# EAGLE design untitled (EAGLE 6.4)
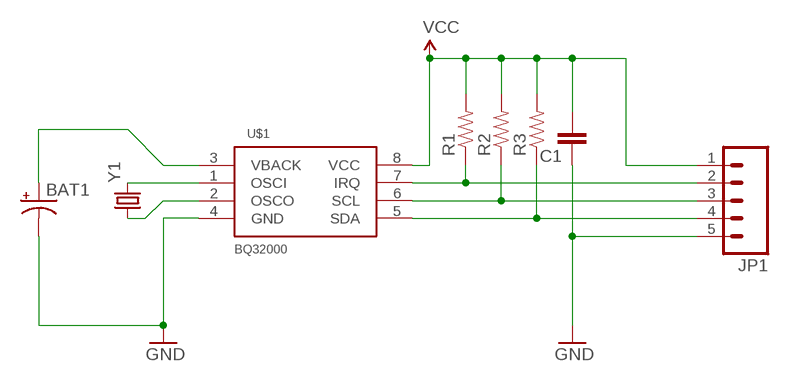
[diagram p0: schematic, sheet 1]

## Parts
BAT1  CAP_POLPTH3  [CPOL-RADIAL-1000UF-63V]
C1  CAP0805  [0805]
JP1  M05LOCK  [1X05_LOCK]
R1  RESISTOR0805-RES  [0805]
R2  RESISTOR0805-RES  [0805]
R3  RESISTOR0805-RES  [0805]
U$1  BQ32000  [SO08]
Y1  CRYSTAL32-SMD  [CRYSTAL-32KHZ-SMD]

## Nets
GND: BAT1.2(-) C1.1 JP1.5 U$1.4(GND)
N$1: BAT1.1(+) U$1.3(VBACK)
N$2: JP1.2 R1.1 U$1.7(IRQ)
N$3: JP1.3 R2.1 U$1.6(SCL)
N$4: JP1.4 R3.1 U$1.5(SDA)
N$5: U$1.1(OSCI) Y1.X2
N$6: U$1.2(OSCO) Y1.X1
VCC: C1.2 JP1.1 R1.2 R2.2 R3.2 U$1.8(VCC)

## Library data of the parts
BAT1 = SparkFun-Capacitors:CAP_POL: Capacitor Polarized These are standard SMD and PTH capacitors. Normally 10uF, 47uF, and 100uF in electrolytic and tantalum varieties. Always verify the external diameter of the through hole cap, it varies with capacity, voltage, and manufacturer. The EIA devices should be standard.
C1 = SparkFun-Passives:CAP: Capacitor Standard 0603 ceramic capacitor, and 0.1" leaded capacitor.
JP1 = SparkFun-Connectors:M05: Header 5 Standard 5-pin 0.1" header. Use with straight break away headers (SKU : PRT-00116), right angle break away headers (PRT-00553), swiss pins (PRT-00743), machine pins (PRT-00117), and female headers (PRT-00115). Molex polarized connector foot print use with SKU : PRT-08230 with associated crimp pins and housings.
R1-R3 = SparkFun-Passives:RESISTOR: Resistor Basic schematic elements and footprints for 0603, 1206, and PTH resistors.
U$1 = custom:BQ32000
Y1 = SparkFun-FreqCtrl:CRYSTAL: Various standard crystals. Proven footprints. Spark Fun Electronics SKU : COM-00534

## Board
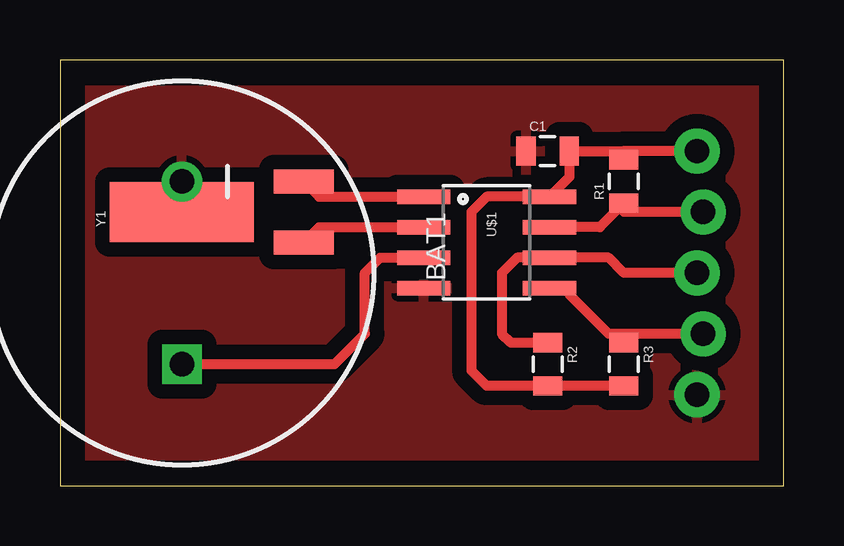
[diagram p1: board, top side]
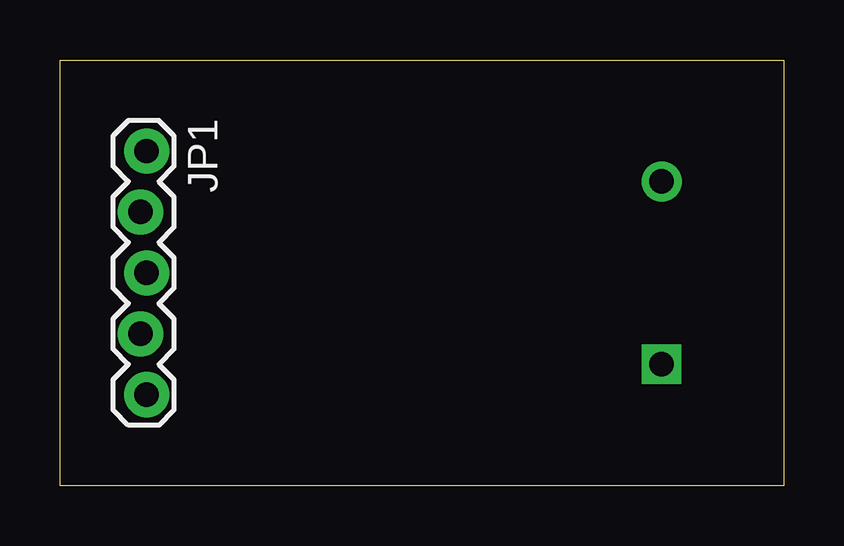
[diagram p2: board, bottom side, seen from below]

Size 30.15 x 17.77 mm. Coordinates in mm from the lower left corner, seen from the top.
Outline: 0,0 30.15,0 30.15,17.77 0,17.77 0,0
Copper layers (1*16): Top 0.035mm / dielectric 1.5mm / Bottom 0.035mm
Design rules "default": minimum track width 10mil, minimum drill 24mil, track to track 8mil, track to pad 8mil, pad to pad 8mil, via to via 8mil, smd to smd 8mil, copper to edge 40mil, drill to drill 8mil, minimum pad ring 10mil, minimum via ring 8mil, stop-mask expansion 4mil, vias tented up to drill 0mil, thermal gap 10mil

### Footprints (pad centres in the part's own frame; a part is rotated, then mirrored left to right if it is on the bottom)
CPOL-RADIAL-1000UF-63V = drill 1.016 pad 1.651 square: 1 3.81,0 | drill 1.016 pad 1.676: 2 -3.81,0
0805 = smd 0.8 x 1.2: 1 -0.9,0; 2 0.9,0
1X05_LOCK = drill 1.016 pad 1.88: 1 0,0.127; 2 2.54,-0.127; 3 5.08,0.127; 4 7.62,-0.127; 5 10.16,0.127
SO08 = smd 0.61 x 2.21: 1 -1.905,-2.616; 2 -0.635,-2.616; 3 0.635,-2.616; 4 1.905,-2.616; 5 1.905,2.616; 6 0.635,2.616; 7 -0.635,2.616; 8 -1.905,2.616
CRYSTAL-32KHZ-SMD = smd 2.5 x 6: SHEILD 0,5.08 | smd 1 x 2.5: X1 -1.27,0; X2 1.27,0

### Placement (x,y rotation side)
BAT1  5.08,8.89 270 top
C1  20.32,13.97 0 top
JP1  26.67,13.97 270 bottom
R1  23.5,12.7 90 top
R2  20.32,5.08 270 top
R3  23.5,5.08 270 top
U$1  17.78,10.16 270 top
Y1  10.16,11.43 90 top

### Tracks (layer width: path | path; a pad name or v marks a point on that pad's centre or on a via)
GND
  pour Top (isolate 0.61): 0,16.51 29.21,16.51 29.21,1.27 0,1.27
N$1
  Top 0.406: U$1.3 13.34,9.53 12.7,8.89 12.7,6.35 11.43,5.08 BAT1.1
N$2
  Top 0.406: JP1.2 23.5,11.43 R1.1 22.49,10.79 U$1.7
N$3
  Top 0.406: R2.1 18.79,5.98 18.41,6.35 18.41,8.89 19.05,9.53 U$1.6 22.86,9.53 23.5,8.89 JP1.3
N$4
  Top 0.406: U$1.5 21.22,8.26 21.22,7.99 22.86,6.35 23.5,6.35 | JP1.4 23.5,6.35 | R3.1 23.5,6.35
N$5
  Top 0.406: Y1.X2 10.79,12.06 U$1.1
N$6
  Top 0.406: Y1.X1 10.79,10.79 U$1.2
VCC
  Top 0.406: JP1.1 23.5,13.97 | R1.2 23.5,13.97 | R3.2 R2.2 17.78,4.18 17.14,4.82 17.14,11.43 17.78,12.06 U$1.8 21.22,12.89 C1.2 23.5,13.97